# Altium schematic sheet 原理图_2021-06-02.schdoc
size 281 x 168 mm
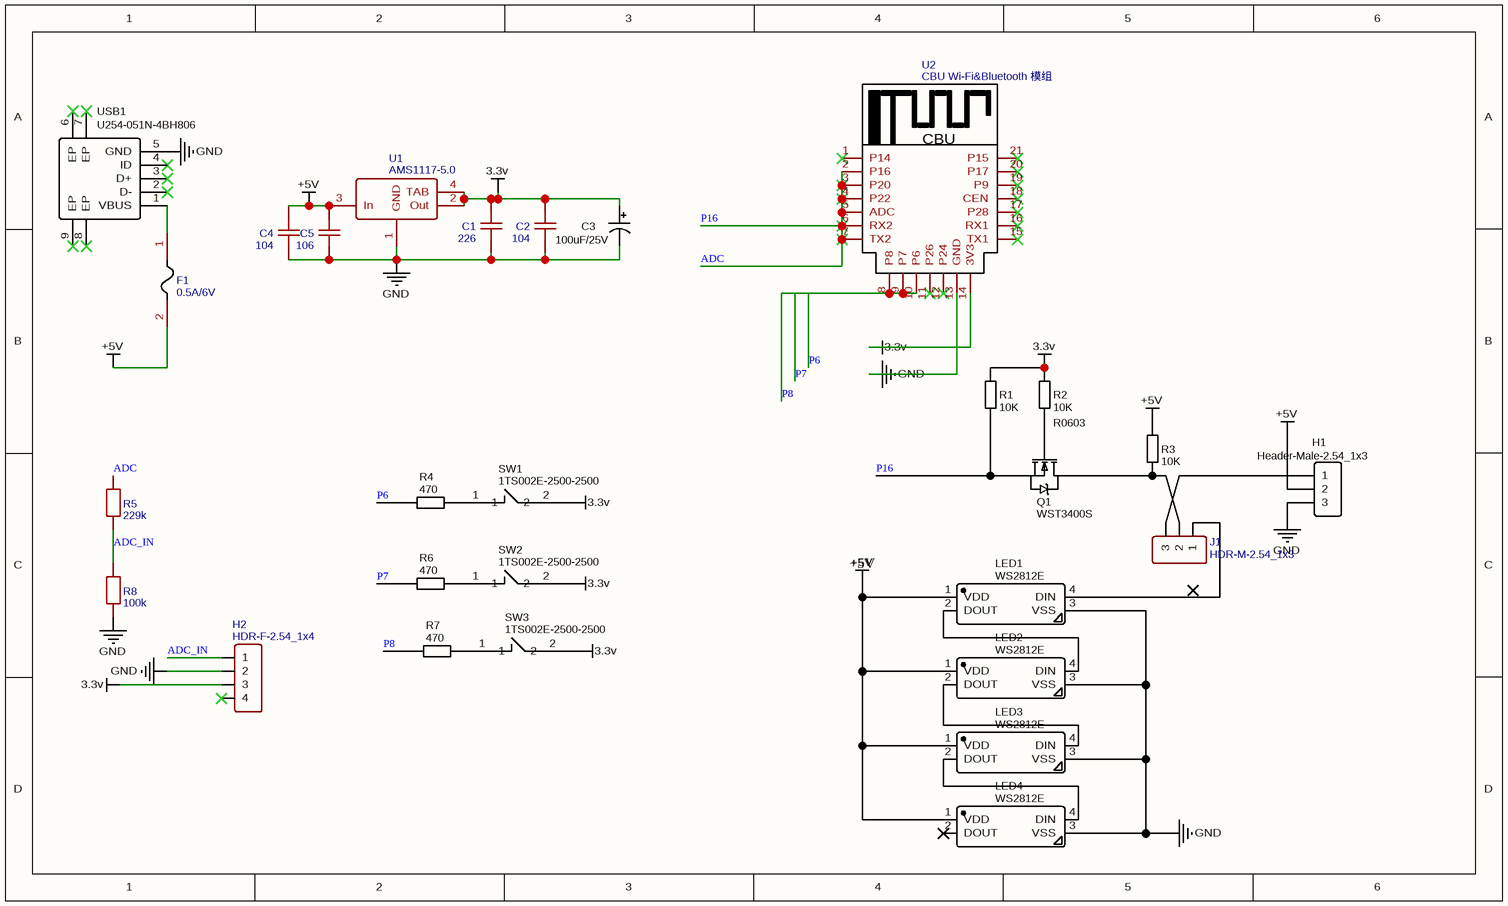
[diagram p0: 原理图_2021-06-02.schdoc]

## Parts
C1  226  [C0603]
C2  104  [C0603]
C3  100uF/25V  [CAP-SMD_BD6.3-L6.6-W6.6-FD]
C4  104  [C0603]
C5  106  [C0603]
F1  0.5A/6V  [0805_L_JX]
H1  Header-Male-2.54_1x3  [HDR-TH_3P-P2.54-V]
H2  HDR-F-2.54_1x4  [HDR-F-2.54_1X4]
J1  HDR-M-2.54_1x3  [HDR-M-2.54_1X3]
LED1  WS2812E  [LED-SMD_4P-L5.0-W5.0-BR]
LED2  WS2812E  [LED-SMD_4P-L5.0-W5.0-BR]
LED3  WS2812E  [LED-SMD_4P-L5.0-W5.0-BR]
LED4  WS2812E  [LED-SMD_4P-L5.0-W5.0-BR]
Q1  WST3400S  [SOT-23-3_L2.9-W1.6-P1.90-LS2.8-BR]
R1  10K  [R0603]
R2  10K  [R0603]
R3  10K  [R0603]
R4  470  [R0603]
R5  229k  [R0805]
R6  470  [R0603]
R7  470  [R0603]
R8  100k  [R0805]
SW1  1TS002E-2500-2500  [KEY-SMD_L6.1-W3.7-LS8.0]
SW2  1TS002E-2500-2500  [KEY-SMD_L6.1-W3.7-LS8.0]
SW3  1TS002E-2500-2500  [KEY-SMD_L6.1-W3.7-LS8.0]
U1  AMS1117-5.0  [SOT-223_L6.5-W3.5-P2.30-LS7.0-BR]
U2  CBU Wi-Fi&Bluetooth 模组  [CBU WIFI&BLUETOOTH]
USB1  U254-051N-4BH806  [MICRO-USB-SMD_U254-051N-4BH806]

## Nets
3.3v: C1.2 C2.2 C3.1 H2.3 R1.1 R2.1 SW1.2 SW2.2 SW3.2 U1.2(Out) U1.4(TAB) U2.14(3V3)
+5V: C4.2 C5.2 F1.2 H1.2 LED1.1(VDD) LED2.1(VDD) LED3.1(VDD) LED4.1(VDD) R3.1 U1.3(In)
GND: C1.1 C2.1 C3.2 C4.1 C5.1 H1.3 H2.2 LED1.3(VSS) LED2.3(VSS) LED3.3(VSS) LED4.3(VSS) R8.1 U1.1(GND) U2.13(GND) USB1.5(GND)
ADC: Q1.2(S) R1.2 R5.2 U2.2(P16) U2.3(P20) U2.4(P22) U2.5(ADC) U2.6(RX2) U2.7(TX2)  [also labelled P16]
ADC_IN: H2.1 R5.1 R8.2
P6: R4.2 R6.2 R7.2 U2.8(P8) U2.9(P7) U2.10(P6)  [also labelled P7, P8]
NetF1_1: F1.1 USB1.1(VBUS)
NetH1_1: H1.1 J1.3
NetJ1_1: J1.1 LED1.4(DIN)
NetJ1_2: J1.2 Q1.3(D) R3.2
NetLED1_2: LED1.2(DOUT) LED2.4(DIN)
NetLED2_2: LED2.2(DOUT) LED3.4(DIN)
NetLED3_2: LED3.2(DOUT) LED4.4(DIN)
NetQ1_1: Q1.1(G) R2.2
NetR4_1: R4.1 SW1.1
NetR6_1: R6.1 SW2.1
NetR7_1: R7.1 SW3.1

Not connected (* = marked no-connect by the designer): H2 4*; LED4 2(DOUT)*; U2 1(P14)* 11(P26)* 12(P24)* 15(TX1)* 16(RX1)* 17(P28)* 18(CEN)* 19(P9)* 20(P17)* 21(P15)*; USB1 2(D-)* 3(D+)* 4(ID)* 6(EP)* 7(EP)* 8(EP)* 9(EP)*

## Notes on the sheet
- +5V
- (in symbol 10K) R0603
- (in symbol CBU Wi-Fi&Bluetooth 模组) CBU

## Library data of the parts
C1 = 226: nameAlias: Value(F); BOM_Manufacturer Part: ?; spicePre: C; spiceSymbolName: Capacitor
C2 C4 = 104: nameAlias: Value(F); BOM_Manufacturer Part: ?; spicePre: C; spiceSymbolName: Capacitor
C3 = 100uF/25V: BOM_Manufacturer: HONOR; BOM_Manufacturer Part: RVT1E101M0607; nameAlias: Capacitance; Package Display: No; BOM_Supplier: LCSC; BOM_Supplier Part: C3338; spicePre: C; spiceSymbolName: RVT1E101M0607
C5 = 106: nameAlias: Value(F); BOM_Manufacturer Part: ?; spicePre: C; spiceSymbolName: Capacitor
H1 = Header-Male-2.54_1x3: BOM_Manufacturer: BOOMELE; BOM_Manufacturer Part: Header2.54mm 1*3P; BOM_Supplier: LCSC; image: //image.lceda.cn/szlcsc/C49257.jpg; BOM_Supplier Part: C49257; spicePre: H; spiceSymbolName: Header-Male-2.54_1x3
H2 = HDR-F-2.54_1x4: Contributor: LCEDA_Lib; BOM_Supplier Part: C225501; BOM_Supplier: LCSC; spicePre: H; spiceSymbolName: HDR-F-2.54_1x4
J1 = HDR-M-2.54_1x3: Contributor: LCEDA_Lib; BOM_Supplier Part: C180248; BOM_Supplier: LCSC; spicePre: J; spiceSymbolName: HDR-M-2.54_1x3
LED1-LED4 = WS2812E: BOM_Manufacturer: Worldsemi; Contributor: LCSC; BOM_Paste Type: recommend; BOM_Supplier: LCSC; BOM_Supplier Part: C139127; BOM_Manufacturer Part: WS2812E; spicePre: L; spiceSymbolName: WS2812E
Q1 = WST3400S: BOM_Manufacturer: WINSOK; SMT Type: Extend; BOM_Supplier: LCSC; BOM_Manufacturer Part: WST3400S; BOM_Supplier Part: C105164; BOM_LCSC Assembly: Yes; spicePre: Q; spiceSymbolName: WST3400S
R1 R3 = 10K: BOM_Manufacturer: YAGEO; BOM_Manufacturer Part: RC0603JR-0710KL; nameAlias: Resistance (Ohms); BOM_Supplier: LCSC; BOM_Supplier Part: C99198; spicePre: R; spiceSymbolName: RC0603JR-0710KL
R2 = 10K: BOM_Manufacturer: YAGEO; BOM_Manufacturer Part: RC0603JR-0710KL; nameAlias: Resistance (Ohms); Package Display: Yes; BOM_Supplier: LCSC; BOM_Supplier Part: C99198; spicePre: R; spiceSymbolName: RC0603JR-0710KL
R4 R6 R7 = 470: BOM_Manufacturer: UniOhm; BOM_Manufacturer Part: 0603WAJ0471T5E; nameAlias: Resistance (Ohms); BOM_Supplier: LCSC; BOM_Supplier Part: C25241; spicePre: R; spiceSymbolName: 0603WAJ0471T5E
R5 = 229k: nameAlias: Value(Ω); Contributor: LCEDA_Lib; spicePre: R; spiceSymbolName: R_0805_EU
R8 = 100k: nameAlias: Value(Ω); Contributor: LCEDA_Lib; spicePre: R; spiceSymbolName: R_0805_EU
SW1-SW3 = 1TS002E-2500-2500: BOM_Manufacturer: HYP; Contributor: LCSC; BOM_Supplier: LCSC; BOM_Supplier Part: C329185; BOM_Manufacturer Part: 1TS002E-2500-2500; spicePre: S; spiceSymbolName: 1TS002E-2500-2500
U1 = AMS1117-5.0: BOM_Manufacturer: AMS; sourceId: HltLFyQwq; SMT Type: Basic; timeStamp: 1466676067; BOM_Supplier: LCSC; BOM_Manufacturer Part: AMS1117-5.0; BOM_LCSC Assembly: Yes; image: //image.lceda.cn/szlcsc/C6187.jpg; BOM_Supplier Part: C6187; spicePre: U; spiceSymbolName: AMS1117-5.0
U2 = CBU Wi-Fi&Bluetooth 模组: Contributor: chenlf; BOM_Supplier: Tuya; spicePre: U; spiceSymbolName: CBU Wi-Fi&amp;Bluetooth 模组
USB1 = U254-051N-4BH806: BOM_Manufacturer: XKB Enterprise; Contributor: LCSC; Package Display: No; BOM_Supplier: LCSC; BOM_Supplier Part: C319170; BOM_Manufacturer Part: U254-051N-4BH806; spicePre: U; spiceSymbolName: U254-051N-4BH806
F1 = 0.5A/6V: BOM_Supplier: LCSC; spicePre: F